# Altium schematic sheet TopView.SchDoc
size 431 x 279 mm; Organization: ORGANIZATION; Address1: ADDRESS 1; Address2: ADDRESS 2; Address3: ADDRESS 3; Address4: ADDRESS 4; Revision: -; SheetNumber: 1; SheetTotal: 4; ENG_APP_DATE: --/--/--; DSN_APP_DATE: --/--/--; CHK_APP_DATE: --/--/--
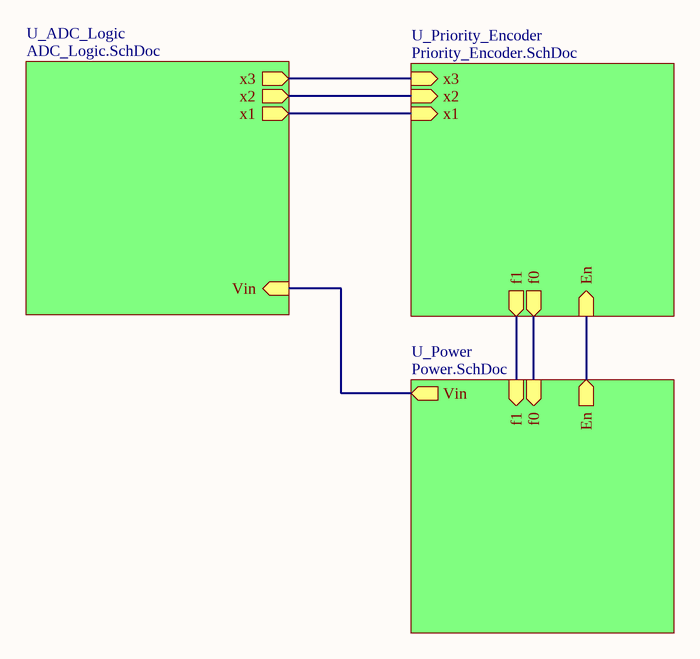
[diagram p0: TopView.SchDoc]

## Sub-sheets
U_ADC_Logic = ADC_Logic.SchDoc: x3 (out), x2 (out), x1 (out), Vin (in)
U_Power = Power.SchDoc: En (out), f0 (in), f1 (in), Vin (out)
U_Priority_Encoder = Priority_Encoder.SchDoc: x1 (in), x2 (in), x3 (in), En (in), f0 (out), f1 (out)

## Nets
(unnamed): sheet U_ADC_Logic/x3, sheet U_Priority_Encoder/x3
(unnamed): sheet U_ADC_Logic/x2, sheet U_Priority_Encoder/x2
(unnamed): sheet U_ADC_Logic/x1, sheet U_Priority_Encoder/x1
(unnamed): sheet U_ADC_Logic/Vin, sheet U_Power/Vin
(unnamed): sheet U_Power/En, sheet U_Priority_Encoder/En
(unnamed): sheet U_Power/f0, sheet U_Priority_Encoder/f0
(unnamed): sheet U_Power/f1, sheet U_Priority_Encoder/f1

## Notes on the sheet
- DWG. NO.
- REV.
- SHT.
- THIS DOCUMENT AND THE DATA DISCLOSED HEREIN OR HEREWITH IS THE PROPERTY OF ALTIUM LIMITED AND MAY BE FREELY DISTRIBUTED IN WHOLE. NO RIGHTS ARE RESERVED OR EXPRESS OR IMPLIED WARANTEE GIVEN.
- REVISION
- DESCRIPTION
- DATE
- APPROVED
- ENG:
- APPROVALS
- PROJECT
- DSN:
- CHK:
- REFERENCE DOCUMENTS
- PROJECT REVISION:
- TITLE
- DOCUMENT REVISION:
- DESIGN ITEM:
- BOM:
- FAB DWG:
- PCB DWG:
- ASSY DWG:
- SCALE:
- SIZE
- B
- CAGE CODE
- FILE NAME
- DWG NO.
- SHEET
- OF
- REV